# Altium schematic sheet LaserProtection_Top_V10.SchDoc
size A3; Organization: University of Amsterdam; Address1: Technology Centre; DocumentNumber: 1; SheetNumber: 1; SheetTotal: 1
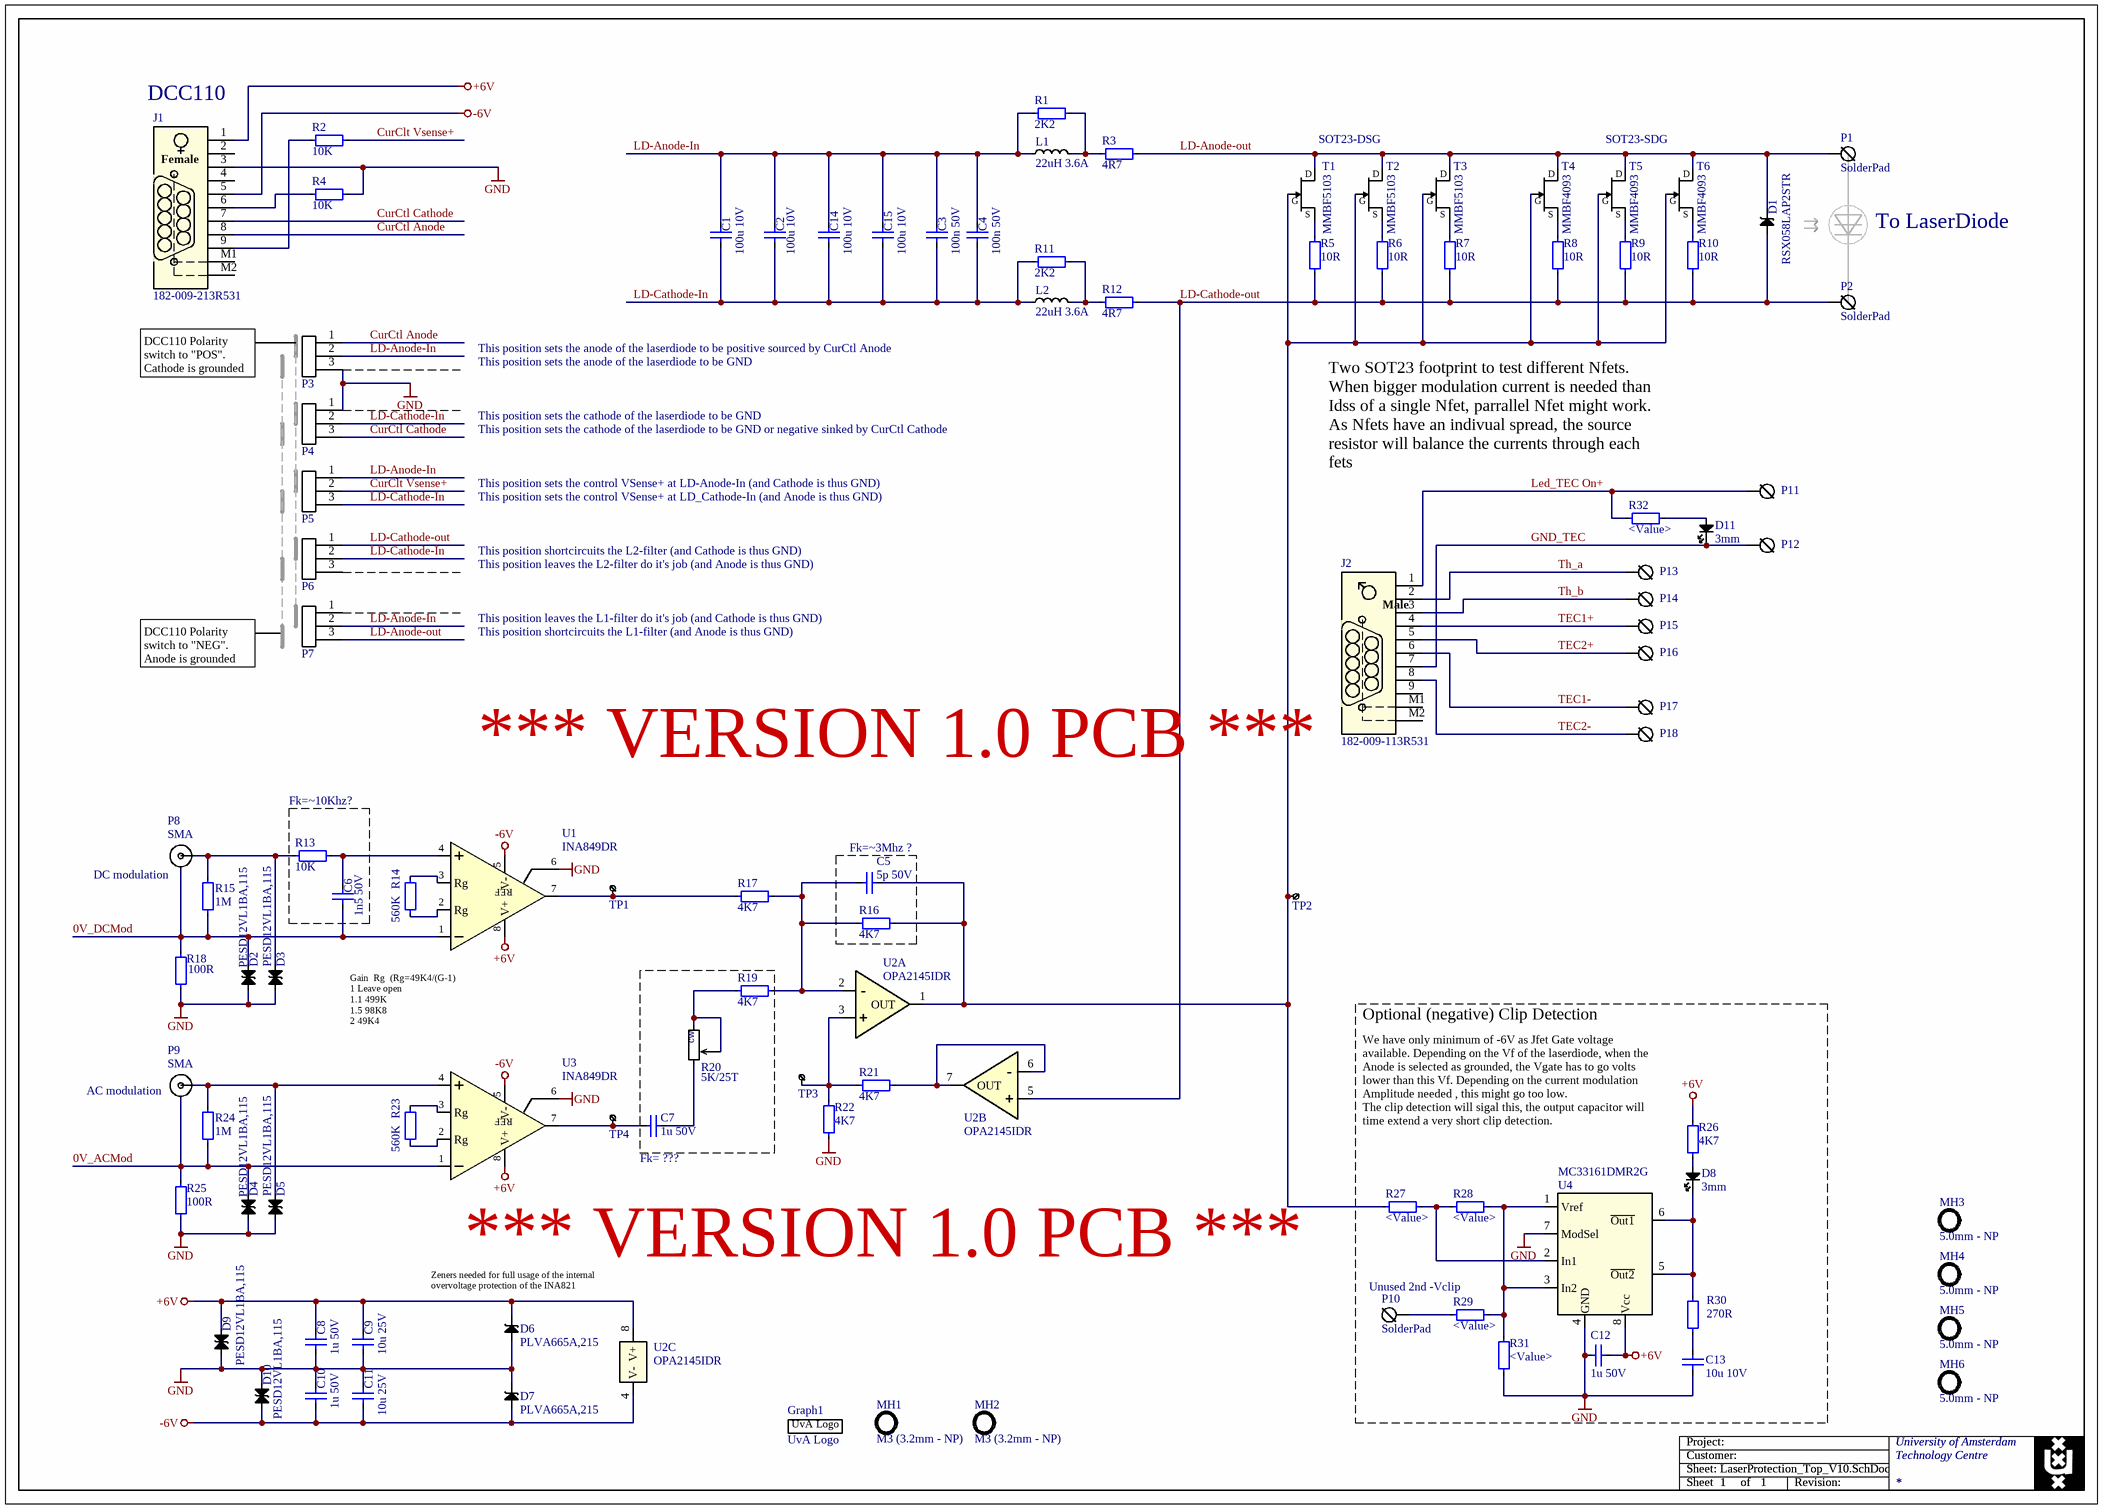
[diagram p0: LaserProtection_Top_V10.SchDoc]

## Parts
C1  100u 10V  [cap1206MD]
C2  100u 10V  [cap1206MD]
C3  100n 50V  [cap0603MD]
C4  100n 50V  [cap0603MD]
C5  5p 50V  [cap0603MD]
C6  1n5 50V  [cap0603MD]
C7  1u 50V  [cap0603MD]
C8  1u 50V  [cap0603MD]
C9  10u 25V  [cap0805MD]
C10  1u 50V  [cap0603MD]
C11  10u 25V  [cap0805MD]
C12  1u 50V  [cap0603MD]
C13  10u 10V  [cap0603MD]
C14  100u 10V  [cap1206MD]
C15  100u 10V  [cap1206MD]
D1  RSX058LAP2STR  [SODFL470X110-2N]
D2  PESD12VL1BA,115  [SOD-323-2-NoPol]
D3  PESD12VL1BA,115  [SOD-323-2-NoPol]
D4  PESD12VL1BA,115  [SOD-323-2-NoPol]
D5  PESD12VL1BA,115  [SOD-323-2-NoPol]
D6  PLVA665A,215  [SOT95P230X110-3N]
D7  PLVA665A,215  [SOT95P230X110-3N]
D8  3mm  [LED_3mm]
D9  PESD12VL1BA,115  [SOD-323-2-NoPol]
D10  PESD12VL1BA,115  [SOD-323-2-NoPol]
D11  3mm  [LED_3mm]
Graph1  UvA Logo  [UVA_LOGO_SMALL_HOR]
J1  182-009-213R531  [182-009-213Ryy1]
J2  182-009-113R531  [182-009-113Ryy1]
L1  22uH 3.6A  [INDP102100X51N]
L2  22uH 3.6A  [INDP102100X51N]
MH1  M3 (3.2mm - NP)  [MountHole M3 NP keepout 6_5mm]
MH2  M3 (3.2mm - NP)  [MountHole M3 NP keepout 6_5mm]
MH3  5.0mm - NP  [MountHole 5mm NP No keepout]
MH4  5.0mm - NP  [MountHole 5mm NP No keepout]
MH5  5.0mm - NP  [MountHole 5mm NP No keepout]
MH6  5.0mm - NP  [MountHole 5mm NP No keepout]
P1  SolderPad  [Pad_PT_c15h07mm]
P2  SolderPad  [Pad_PT_c15h07mm]
P3  Header 2.54  [Header254-1x3]  (value not drawn)
P4  Header 2.54  [Header254-1x3]  (value not drawn)
P5  Header 2.54  [Header254-1x3]  (value not drawn)
P6  Header 2.54  [Header254-1x3]  (value not drawn)
P7  Header 2.54  [Header254-1x3]  (value not drawn)
P8  SMA  [PCB114SMAFSTJ]
P9  SMA  [PCB114SMAFSTJ]
P10  SolderPad  [Pad_SMD_c20mm]
P11  SolderPad  [Pad_PT_c16h08mm]  (value not drawn)
P12  SolderPad  [Pad_PT_c16h08mm]  (value not drawn)
P13  SolderPad  [Pad_PT_c16h08mm]  (value not drawn)
P14  SolderPad  [Pad_PT_c16h08mm]  (value not drawn)
P15  SolderPad  [Pad_PT_c20h10mm]  (value not drawn)
P16  SolderPad  [Pad_PT_c20h10mm]  (value not drawn)
P17  SolderPad  [Pad_PT_c20h10mm]  (value not drawn)
P18  SolderPad  [Pad_PT_c20h10mm]  (value not drawn)
R1  2K2  [res1206MD]
R2  10K  [res0603MD]
R3  4R7  [RES2512MD]
R4  10K  [res0603MD]
R5  10R  [res0603MD]
R6  10R  [res0603MD]
R7  10R  [res0603MD]
R8  10R  [res0603MD]
R9  10R  [res0603MD]
R10  10R  [res0603MD]
R11  2K2  [res1206MD]
R12  4R7  [RES2512MD]
R13  10K  [res0603MD]
R14  560K  [res0603MD]
R15  1M  [res0603MD]
R16  4K7  [res0603MD]
R17  4K7  [res0603MD]
R18  100R  [res0603MD]
R19  4K7  [res0603MD]
R20  5K/25T  [Bourns 3296Y]
R21  4K7  [res0603MD]
R22  4K7  [res0603MD]
R23  560K  [res0603MD]
R24  1M  [res0603MD]
R25  100R  [res0603MD]
R26  4K7  [res0603MD]
R27  <Value>  [res0603MD]
R28  <Value>  [res0603MD]
R29  <Value>  [res0603MD]
R30  270R  [res0603MD]
R31  <Value>  [res0603MD]
R32  <Value>  [res0805HD]
T1  MMBF5103  [SOT95P230X110-3N]
T2  MMBF5103  [SOT95P230X110-3N]
T3  MMBF5103  [SOT95P230X110-3N]
T4  MMBF4093  [SOT95P230X110-3N]
T5  MMBF4093  [SOT95P230X110-3N]
T6  MMBF4093  [SOT95P230X110-3N]
TP1  Testpoint  [Testpoint_1mm5]  (value not drawn)  (no BOM)
TP2  Testpoint  [Testpoint_1mm5]  (value not drawn)  (no BOM)
TP3  Testpoint  [Testpoint_1mm5]  (value not drawn)  (no BOM)
TP4  Testpoint  [Testpoint_1mm5]  (value not drawn)  (no BOM)
U1  INA849DR  [SOIC127P600X175-8N]
U2  OPA2145IDR  [SOIC127P600X175-8N]  (parts A,B,C of 3)
U3  INA849DR  [SOIC127P600X175-8N]
U4  MC33161DMR2G  [TSOP65P490X110-8N]

## Blocks framed on the sheet
Fk=~10Khz?: C6 R13
Fk=~3Mhz ?: C5 R16
Optional (negative) Clip Detection: C12 C13 D8 P10 R26-R31 U4

## Nets
+6V: C8.2 C9.2 C12.1 D6.3(C) D9.2 J1.1 R26.1 U1.8(V+) U2.8(V+) U3.8(V+) U4.8(Vcc)
-6V: C10.1 C11.1 D7.1(A) D10.1 J1.5 U1.5(V-) U2.4(V-) U3.5(V-)
GND: C8.1 C9.1 C10.2 C11.2 C12.2 C13.2 D2.1 D3.1 D4.1 D5.1 D6.1(A) D7.3(C) D9.1 D10.2 J1.3 P3.3 P4.1 R4.2 R18.1 R22.1 R25.1 R31.2 U1.6(-) U3.6(-) U4.4(GND) U4.7(ModSel)
0V_ACMod: D4.2 P9.2 R24.1 R25.2 U3.1(-)
0V_DCMod: C6.2 D2.2 P8.2 R15.1 R18.2 U1.1(-)
CurClt Vsense+: P5.2 R2.2
CurCtl Anode: J1.8 P3.1
CurCtl Cathode: J1.7 P4.3
GND_TEC: D11.1 J2.7 P12.1
LD-Anode-In: C1.1 C2.1 C3.1 C4.1 C14.1 C15.1 L1.1 P3.2 P5.1 P7.2 R1.1
LD-Anode-out: D1.1 P1.1 P7.3 R3.2 T1.1(D) T2.1(D) T3.1(D) T4.2(D) T5.2(D) T6.2(D)
LD-Cathode-In: C1.2 C2.2 C3.2 C4.2 C14.2 C15.2 L2.1 P4.2 P5.3 P6.2 R11.1
LD-Cathode-out: D1.2 P2.1 P6.1 R5.1 R6.1 R7.1 R8.1 R9.1 R10.1 R12.2 U2.5(+)
Led_TEC On+: J2.1 P11.1 R32.1
TEC1+: J2.4 P15.1
TEC1-: J2.6 P17.1
TEC2+: J2.5 P16.1
TEC2-: J2.8 P18.1
Th_a: J2.2 P13.1
Th_b: J2.3 P14.1
NetC5_1: C5.1 R16.1 R17.2 R19.2 U2.2(-)
NetC5_2: C5.2 R16.2 R27.1 T1.3(G) T2.3(G) T3.3(G) T4.3(G) T5.3(G) T6.3(G) TP2.1 U2.1(OUT)
NetC6_1: C6.1 R13.2 U1.4(-)
NetC7_1: C7.1 TP4.1 U3.7(-)
NetC7_2: C7.2 R20.1
NetC13_1: C13.1 R30.1
NetD3_2: D3.2 P8.1 R13.1 R15.2
NetD5_2: D5.2 P9.1 R24.2 U3.4(-)
NetD8_1: D8.1 R30.2 U4.5(~{Out2}) U4.6(~{Out1})
NetD8_2: D8.2 R26.2
NetD11_2: D11.2 R32.2
NetJ1_6: J1.6 R4.1
NetJ1_9: J1.9 R2.1
NetL1_2: L1.2 R1.2 R3.1
NetL2_2: L2.2 R11.2 R12.1
NetP10_1: P10.1 R29.1
NetR5_2: R5.2 T1.2(S)
NetR6_2: R6.2 T2.2(S)
NetR7_2: R7.2 T3.2(S)
NetR8_2: R8.2 T4.1(S)
NetR9_2: R9.2 T5.1(S)
NetR10_2: R10.2 T6.1(S)
NetR14_1: R14.1 U1.2(Rg)
NetR14_2: R14.2 U1.3(Rg)
NetR17_1: R17.1 TP1.1 U1.7(-)
NetR19_1: R19.1 R20.2 R20.3
NetR21_1: R21.1 U2.6(-) U2.7(OUT)
NetR21_2: R21.2 R22.2 TP3.1 U2.3(+)
NetR23_1: R23.1 U3.2(Rg)
NetR23_2: R23.2 U3.3(Rg)
NetR27_2: R27.2 R28.1 U4.2(In1)
NetR28_2: R28.2 R29.2 R31.1 U4.1(Vref) U4.3(In2)

Not connected (* = marked no-connect by the designer): J1 2 4 M1 M2; J2 9 M1 M2; P6 3; P7 1

## Notes on the sheet
- (near J1) DCC110
- SOT23-DSG
- SOT23-SDG
- To LaserDiode
- DCC110 Polarity switch to "POS".
  Cathode is grounded
- This position sets the anode of the laserdiode to be positive sourced by CurCtl Anode
- This position sets the anode of the laserdiode to be GND
- This position sets the cathode of the laserdiode to be GND
- This position sets the cathode of the laserdiode to be GND or negative sinked by CurCtl Cathode
- This position sets the control VSense+ at LD-Anode-In (and Cathode is thus GND)
- This position sets the control VSense+ at LD_Cathode-In (and Anode is thus GND)
- (near R32) Two SOT23 footprint to test different Nfets.
  When bigger modulation current is needed than Idss of a single Nfet, parrallel Nfet might work. As Nfets have an indivual spread, the source resistor will balance the currents through each fets
- This position shortcircuits the L2-filter (and Cathode is thus GND)
- This position leaves the L2-filter do it's job (and Anode is thus GND)
- This position shortcircuits the L1-filter (and Anode is thus GND)
- This position leaves the L1-filter do it's job (and Cathode is thus GND)
- DCC110 Polarity switch to "NEG".
  Anode is grounded
- *** VERSION 1.0 PCB ***
- (near P8) DC modulation
- Gain 	Rg  (Rg=49K4/(G-1)
  1	Leave open
  1.1	499K
  1.5	98K8
  2	49K4
- (near P9) AC modulation
- We have only minimum of -6V as Jfet Gate voltage available. Depending on the Vf of the laserdiode, when the Anode is selected as grounded, the Vgate has to go volts lower than this Vf. Depending on the current modulation Amplitude needed , this might go too low.
  The clip detection will sigal this, the output capacitor will time extend a very short clip detection.
- Fk= ???
- Zeners needed for full usage of the internal overvoltage protection of the INA821
- (near U3) *** VERSION 1.0 PCB ***
- Unused 2nd -Vclip
- Project:
- Customer:
- Sheet
- Sheet:
- of
- Revision:
- (in symbol 182-009-113R531) Male
- (in symbol 182-009-213R531) Female
- (in symbol 3296Y-1-502LF) cw
- (in symbol INA849IDR) REF

## Library data of the parts
C1 C2 C14 C15 = C3216X5R1A107M160AC: MLCC 100 µF, 10 V, 1206 [3216 Metric], ± 20%, X5R; Manufacturer: TDK; id: 82; Author: EB; Partname: C3216X5R1A107M160AC; MyComment: 100u 10V; Capacitance: 100u; Precision: 20%; ManufacturerCode: C3216X5R1A107M160AC; Supplier 1: Farnell; Supplier Part Number 1: 2211193; CreationDate: 31-Oct-23 12:19:33; Checked by: Unchecked; Type: Capacitor
C3 C4 = Cap0603MD_100n_X7R_50V_10%: id: 12; Precision: 10%; Type: X7R; Author: TvR; Partname: Cap0603MD_100n_X7R_50V_10%; MyComment: 100n 50V; Capacitance: 100n; Supplier 1: Farnell; Supplier Part Number 1: 2581046; CreationDate: 31-Mar-16 14:01:33; Checked by: Unchecked; Voltage: 50V
C5 = Cap0603MD_5p_NP0_50V_5%: id: 163; Precision: 5%; Type: NP0; Author: Twe; Partname: Cap0603MD_5p_NP0_50V_5%; MyComment: 5p 50V; Capacitance: 5p; Supplier 1: Farnell; Supplier Part Number 1: 1759046; CreationDate: 09-Sep-16 09:35:37; Checked by: Unchecked; Voltage: 50V
C6 = Cap0603MD_1n5_NP0_50V_5%: id: 157; Precision: 5%; Type: NP0; Author: EB; Partname: Cap0603MD_1n5_NP0_50V_5%; MyComment: 1n5 50V; Capacitance: 1n5; Supplier 1: Farnell; CreationDate: 29-Jan-18 11:34:27; Checked by: Unchecked; Voltage: 50V
C7 C8 C10 C12 = Cap0603MD_1u_X5R_50V_10%: id: 123; Precision: 10%; Type: X5R; Author: Twe; Partname: Cap0603MD_1u_X5R_50V_10%; MyComment: 1u 50V; Capacitance: 1u; Supplier 1: Farnell; Supplier Part Number 1: 3013383; CreationDate: 23-Mar-20; Checked by: Unchecked; Voltage: 50V
C9 C11 = Cap0805MD_10u_X5R_25V_10%: id: 146; Precision: 10%; Type: 5XR; Author: EB; Partname: Cap0805MD_10u_X5R_25V_10%; MyComment: 10u 25V; Capacitance: 10u; Supplier 1: Farnell; Supplier Part Number 1: 1735530; CreationDate: 31-Mar-16 14:12:18; Checked by: Unchecked; Voltage: 25V
C13 = Cap0603MD_10u_X7R_10V_10%: id: 51; Precision: 10%; Type: X7R; Author: EB; Partname: Cap0603MD_10u_X7R_10V_10%; MyComment: 10u 10V; Capacitance: 10u; Supplier 1: Mouser; Supplier Part Number 1: 81-GRM188Z71A106KA3D; CreationDate: 09-Sep-16 09:42:50; Checked by: Unchecked; Voltage: 10V
D1 = RSX058LAP2STR: Schottky Diode, 3A, 200V, Vf=0.84 (3A/35C), Ir=5-100nA; Manufacturer: ROHM; id: 65; Author: EB; Partname: RSX058LAP2STR; MyComment: RSX058LAP2STR; Type: Schottky; ManufacturerCode: RSX058LAP2STR; Supplier 1: Mouser; Supplier Part Number 1: 755-RSX058LAP2STR; CreationDate: 17-Sep-19 11:02:04; Checked by: Unchecked
D2-D5 D9 D10 = PESD12VL1BA,115: TVS Diode, Bidirectional, 12V, SOD-323, 2 Pins; Manufacturer: Nexperia; id: 49; Author: EB; Partname: PESD12VL1BA,115; MyComment: PESD12VL1BA,115; Type: TVS; ManufacturerCode: PESD12VL1BA,115; Supplier 1: Farnell; Supplier Part Number 1: 8737363; CreationDate: 13-Oct-22 11:22:44; Checked by: Unchecked
D6 D7 = PLVA665A,215: Zener 6v5, 250mW, 3%, SOT-23; Manufacturer: Rohm; id: 64; Author: EB; Partname: PLVA665A,215; MyComment: PLVA665A,215; Type: Zener; ManufacturerCode: PLVA665A,215; Supplier 1: Mouser; Supplier Part Number 1: 771-PLVA665A215; CreationDate: 28-Jul-23 14:37:29; Checked by: Unchecked
D8 D11 = LED_3mm: Generic 3mm LED Footprint; Manufacturer: Wurth; ManufacturerCode: 151031SS04000; id: 39; Author: EB; Partname: LED_3mm; MyComment: 3mm; Type: LED; Supplier 1: Mouser; Supplier Part Number 1: 710-151031SS04000; CreationDate: 26-May-16 08:35:38; Checked by: Unchecked
Graph1 = UvA_Logo_Small_horizontal: University of Amsterdam Logo; id: 158; Author: EB; Partname: UvA_Logo_Small_horizontal; MyComment: UvA Logo; Type: Logo; Supplier 1: <no part>; CreationDate: 31-Mar-16 13:43:00; Checked by: PCB
J1 = 182-009-213R531: NorComp, D-SUB, 9 pins, Female, right angled PCB; id: 167; Author: EB; Partname: 182-009-213R531; MyComment: 182-009-213R531; Type: D-Sub; Manufacturer: NorComp; ManufacturerCode: 182-009-213R531; Supplier 1: Farnell; Supplier Part Number 1: 2294288; CreationDate: 30-Oct-23 15:57:50; Checked by: Unchecked
J2 = 182-009-113R531: NorComp, D-SUB, 9 pins, Male, right angled PCB; id: 166; Author: EB; Partname: 182-009-113R531; MyComment: 182-009-113R531; Type: D-Sub; Manufacturer: NorComp; ManufacturerCode: 182-009-113R531; Supplier 1: Farnell; Supplier Part Number 1: 2294285; CreationDate: 30-Oct-23 15:57:50; Checked by: Unchecked
L1 L2 = MSS1048T-223MLC: Power Inductor, SMD, 22 µH, 3.58 A, Shielded, 2.36 A; Manufacturer: Coilcraft; id: 60; Precision: 20%; Author: EB; Partname: MSS1048T-223MLC; MyComment: 22uH 3.6A; Inductance: 22uH; Current: 3.6A; Type: Inductor; ManufacturerCode: MSS1048T-223MLC; Supplier 1: Farnell; Supplier Part Number 1: 2288292; CreationDate: 11-Oct-23 12:11:13; Checked by: Unchecked
MH1 MH2 = MountingHole M3 NP: MountingHole NP for M3, drill 3.2mm, keepout dia 6.5; id: 146; Author: EB; Partname: MountingHole M3 NP; MyComment: M3 (3.2mm - NP); Type: Hole NP; Supplier 1: Farnell; CreationDate: 12-Dec-22 11:28:31; Checked by: Unchecked
MH3-MH6 = MountingHole 5.0mm No keepout: MountingHole 5mm No keepout; id: 161; Author: EB; Partname: MountingHole 5.0mm No keepout; MyComment: 5.0mm - NP; Type: Hole NP; Supplier 1: Farnell; CreationDate: 12-Dec-22 11:28:31; Checked by: Unchecked
P1 P2 = SolderPad_PT_c1.5h0.7mm: id: 83; Partname: SolderPad_PT_c1.5h0.7mm; MyComment: SolderPad; Type: SolderPad; Supplier 1: Farnell; Author: EB; CreationDate: 29-Oct-20 13:08:52; Checked by: Unchecked
P3-P7 = Header254-1x3: Header 2.54p 1x3; id: 33; Author: Twe; Partname: Header254-1x3; MyComment: Header 2.54; Type: Header; Supplier 1: Farnell; Supplier Part Number 1: 1022248; CreationDate: 11-Apr-16 15:00:36; Checked by: PCB
P8 P9 = PCB.114SMAFSTJ.A: SMA Coaxial, 17.7mm, 50 Ohm, Straight Jack, Through Hole; Manufacturer: Taoglas; id: 150; Author: EB; Partname: PCB.114SMAFSTJ.A; MyComment: SMA; Type: SMA; ManufacturerCode: PCB.114SMAFSTJ.A; Supplier 1: Mouser; Supplier Part Number 1: 960-PCB.114SMAFSTJ.A; CreationDate: 31-Mar-16 12:11:50; Checked by: Unchecked
P10 = SolderPad_SMD_c2.0mm: id: 87; Partname: SolderPad_SMD_c2.0mm; MyComment: SolderPad; Type: SolderPad; Supplier 1: Farnell; Author: EB; CreationDate: 29-Oct-20 13:45:41; Checked by: Unchecked
P11-P14 = SolderPad_PT_c1.6h0.8mm: id: 84; Partname: SolderPad_PT_c1.6h0.8mm; MyComment: SolderPad; Type: SolderPad; Supplier 1: Farnell; Author: EB; CreationDate: 29-Oct-20 13:08:52; Checked by: Unchecked
P15-P18 = SolderPad_PT_c2.0h1.0mm: id: 86; Partname: SolderPad_PT_c2.0h1.0mm; MyComment: SolderPad; Type: SolderPad; Supplier 1: Farnell; Author: EB; CreationDate: 29-Oct-20 13:08:52; Checked by: Unchecked
R1 R11 = Res1206MD_2K2_1%: id: 538; Precision: 1%; Author: EB; Partname: Res1206MD_2K2_1%; MyComment: 2K2; Resistance: 2K2; Supplier 1: Farnell; CreationDate: 30-Mar-16 10:33:13; Checked by: Unchecked
R2 R4 R13 = Res0603MD_10K_1%: id: 336; Precision: 1%; Author: TvR; Partname: Res0603MD_10K_1%; MyComment: 10K; Resistance: 10K; Supplier 1: Farnell; Supplier Part Number 1: 2446547; CreationDate: 30-Mar-16 10:33:13; Checked by: Unchecked
R3 R12 = RC2512JK-7W4R7L: SMD Chip Resistor, 4.7 ohm, ± 5%, 2 W, 2512; Manufacturer: Yageo; id: 72; Author: EB; Partname: RC2512JK-7W4R7L; MyComment: 4R7; Resistance: 4R7; Precision: 5%; ManufacturerCode: RC2512JK-7W4R7L; Supplier 1: Farnell; Supplier Part Number 1: 1376977; CreationDate: 11-Oct-23 12:33:08; Checked by: Unchecked
R5-R10 = Res0603MD_10R_1%: id: 265; Precision: 1%; Author: Twe; Partname: Res0603MD_10R_1%; MyComment: 10R; Resistance: 10R; Supplier 1: Farnell; Supplier Part Number 1: 2447233; CreationDate: 30-Mar-16 10:33:13; Checked by: Unchecked
R14 R23 = Res0603MD_560K_1%: id: 378; Precision: 1%; Author: Twe; Partname: Res0603MD_560K_1%; MyComment: 560K; Resistance: 560K; Supplier 1: Farnell; Supplier Part Number 1: 9331379; CreationDate: 30-Mar-16 10:33:13; Checked by: Unchecked
R15 R24 = Res0603MD_1M_1%: id: 384; Precision: 1%; Author: Twe; Partname: Res0603MD_1M_1%; MyComment: 1M; Resistance: 1M; Supplier 1: Farnell; Supplier Part Number 1: 2447285; CreationDate: 30-Mar-16 10:33:13; Checked by: Unchecked
R16 R17 R19 R21 R22 R26 = Res0603MD_4K7_1%: id: 328; Precision: 1%; Author: Twe; Partname: Res0603MD_4K7_1%; MyComment: 4K7; Resistance: 4K7; Supplier 1: Farnell; Supplier Part Number 1: 2447385; CreationDate: 30-Mar-16 10:33:13; Checked by: Unchecked
R18 R25 = Res0603MD_100R_1%: id: 288; Precision: 1%; Author: TvR; Partname: Res0603MD_100R_1%; MyComment: 100R; Resistance: 100R; Supplier 1: Farnell; Supplier Part Number 1: 1576263; CreationDate: 30-Mar-16 10:33:13; Checked by: Unchecked
R20 = 3296Y-1-502LF: 5K, 25 Turn, Top adjust thruhole trimpot Bourns 100pm; id: 64; Precision: ±10%; Author: EB; Partname: 3296Y-1-502LF; MyComment: 5K/25T; Resistance: 5K; Manufacturer: Bourns; ManufacturerCode: 3296Y-1-502LF; Supplier 1: Farnell; Supplier Part Number 1: 9353631; CreationDate: 29-Jun-23 07:57:20; Checked by: Unchecked
R27-R29 R31 = Res0603MD_Generic: id: 7; Author: Twe; Partname: Res0603MD_Generic; MyComment: <Value>; Supplier 1: Farnell; CreationDate: 23-Mar-16 11:35:26; Checked by: Unchecked
R30 = Res0603MD_270R_1%: id: 298; Precision: 1%; Author: Twe; Partname: Res0603MD_270R_1%; MyComment: 270R; Resistance: 270R; Supplier 1: Farnell; Supplier Part Number 1: 9330917; CreationDate: 30-Mar-16 10:33:13; Checked by: Unchecked
R32 = Res0805HD_Generic: id: 259; Author: Twe; Partname: Res0805HD_Generic; MyComment: <Value>; Supplier 1: Farnell; CreationDate: 30-Mar-16 10:26:57; Checked by: Unchecked
T1-T3 = MMBF5103: JFET N Channel, VdgMax=40V, Idss=10 to 40mA, VgsOff=-1.2 to-2.7 V, SOT-23-3; Manufacturer: OnSemi; id: 32; Type: FET N; Author: EB; Partname: MMBF5103; MyComment: MMBF5103; ManufacturerCode: MMBF5103; Supplier 1: Farnell; Supplier Part Number 1: 2454011; CreationDate: 18-Oct-23 10:22:07; Checked by: Unchecked
T4-T6 = MMBF4093: JFET N Channel, VdgMax=40V, Idss=8 to ?mA, VgsOff=-1 to -5V, SOT-23-3; Manufacturer: OnSemi; id: 33; Type: FET N; Author: EB; Partname: MMBF4093; MyComment: MMBF4093; ManufacturerCode: MMBF4093; Supplier 1: Farnell; Supplier Part Number 1: 2992317; CreationDate: 18-Oct-23 10:33:18; Checked by: Unchecked
TP1-TP4 = Testpoint_1.5mm: Testpoint SMD pad 1.5mm; id: 143; Author: EB; Partname: Testpoint_1.5mm; MyComment: Testpoint; Type: Testpoint; CreationDate: 31-Mar-16 13:33:27; Checked by: PCB
U1 U3 = INA849IDR: InAmp, noise=1 nV/√Hz, Ofs=35 µV, Bw=28MHz-35V/us, ± 4V to ± 18V, 8V to 36V; Manufacturer: Anolog Devices; id: 244; Partname: INA849IDR; MyComment: INA849DR; Type: InAmp; ManufacturerCode: INA849DR; Supplier 1: Mouser; Supplier Part Number 1: 595-INA849DR; Author: EB; CreationDate: 18-Oct-23 14:25:23; Checked by: Unchecked
U2 = OPA2145IDR: Dual OpAmp, 5.5MHz, Noise=7nV, Ibias=2pA, ±2.3 to ±18v, UnityGain stable, Sot23-5; Manufacturer: Analog Devices; id: 241; Partname: OPA2145IDR; MyComment: OPA2145IDR; Type: OpAmp; ManufacturerCode: OPA2145IDR; Supplier 1: Mouser; Supplier Part Number 1: 595-OPA2145IDR; Author: EB; CreationDate: 05-Jul-22 13:39:52; Checked by: Unchecked
U4 = MC33161DMR2G: 2-40V Window Comparator, internal ref (2.54/1.27V), open collector out; Manufacturer: OnSemi; id: 227; Author: EB; Partname: MC33161DMR2G; MyComment: MC33161DMR2G; Type: Comparator; ManufacturerCode: MC33161DMR2G; Supplier 1: farnell; Supplier Part Number 1: 2774746; CreationDate: 27-Jun-23 08:40:04; Checked by: Unchecked